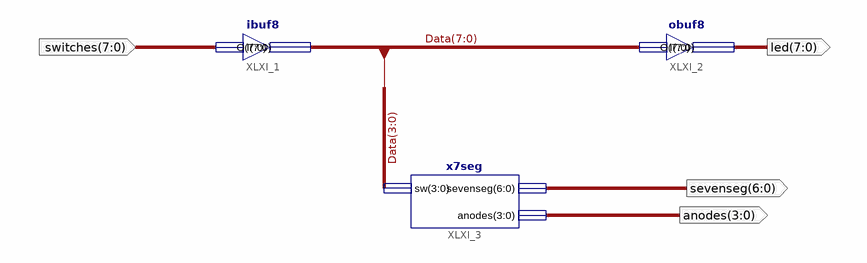
[diagram p0: schematic sheet 1]
// Xilinx ISE schematic toplevel.sch (spartan3e) as structural Verilog: 3 symbols, 4 ports
module toplevel (
  input  [7:0] switches,
  output [7:0] led,
  output [6:0] sevenseg,
  output [3:0] anodes
);

  wire [7:0] Data;

  ibuf8 XLXI_1 (.I(switches), .O(Data));
  obuf8 XLXI_2 (.I(Data), .O(led));
  x7seg XLXI_3 (.sw(Data[3:0]), .sevenseg(sevenseg), .anodes(anodes));
endmodule
